# EAGLE design PIC_Workshop_V1 (EAGLE 9.4.0)
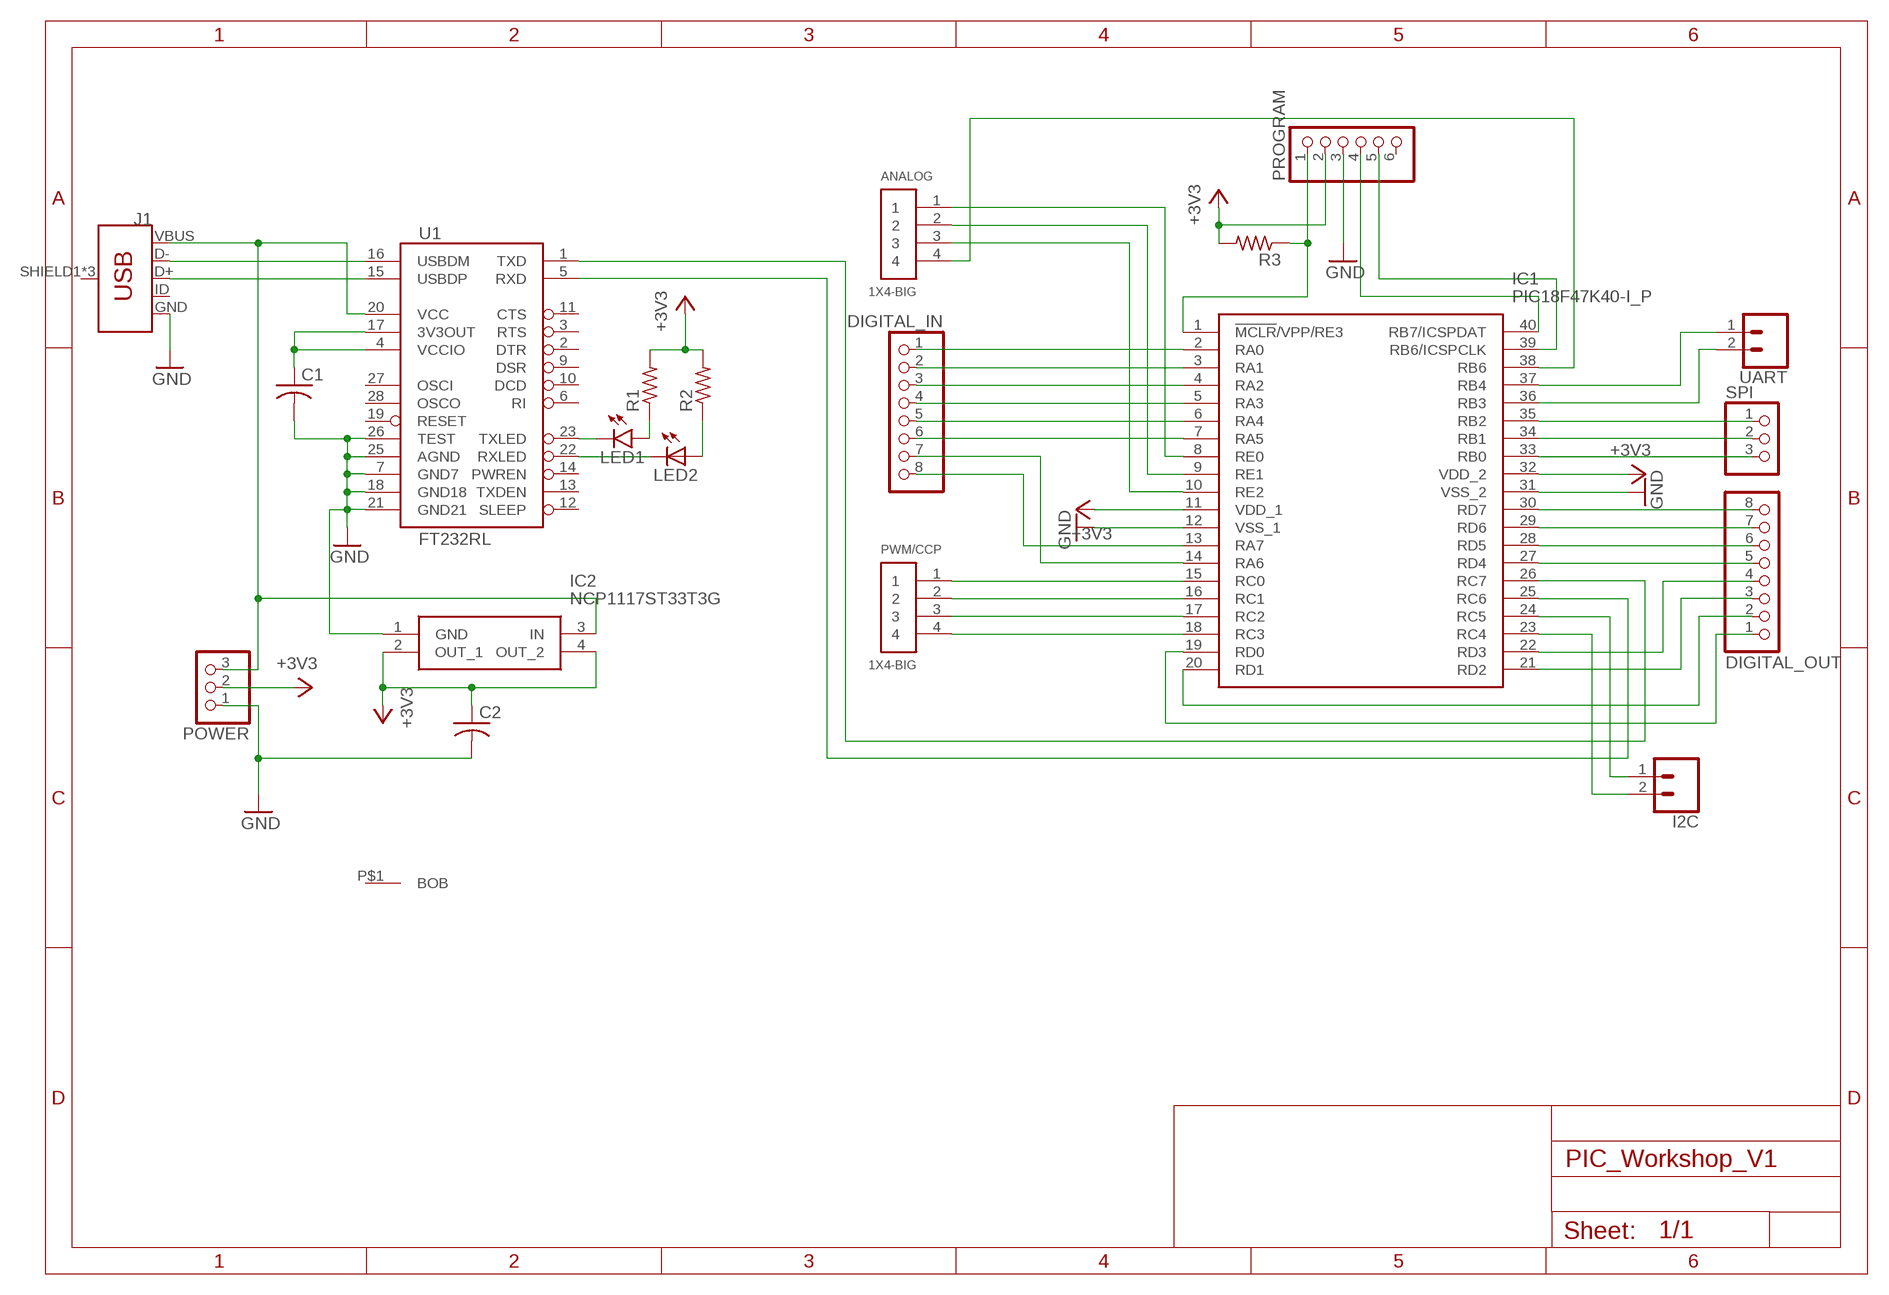
[diagram p0: schematic, sheet 1]

## Parts
ANALOG  1X4-BIG  [1X04-BIG]
C1  C-USC0805  [C0805]
C2  C-USC0805  [C0805]
DIGITAL_IN  PINHD-1X8BIG  [1X08-BIG]
DIGITAL_OUT  PINHD-1X8BIG  [1X08-BIG]
I2C  CONN_02  [1X02]
IC1  PIC18F47K40-I_P  [DIP1543W58P254L5175H635Q40N]
IC2  NCP1117ST33T3G  [SOT230P700X180-4N]
J1  USB_MICRO-BREDUCED_PASTE  [USB-B-MICRO-SMD_RED_PASTE]
LED1  LED3MM  [LED3MM]
LED2  LEDCHIPLED_0603  [CHIPLED_0603]
POWER  PINHD-1X3  [1X03]
PROGRAM  PINHD-1X6  [1X06]
PWM/CCP  1X4-BIG  [1X04-BIG]
R1  R-US_0204/7  [0204/7]
R2  R-US_M0805  [M0805]
R3  R-US_M0805  [M0805]
SPI  PINHD-1X3  [1X03]
U1  FT232RL  FT232RLSSOP  [SSOP28DB]
U$1  BOBBOB  [BOB]
UART  CONN_02  [1X02]

## Nets
+3V3: C2.1 IC1.11(VDD_1) IC1.32(VDD_2) IC2.2(OUT_1) IC2.4(OUT_2) POWER.2 PROGRAM.2 R1.2 R2.2 R3.2
GND: C1.2 C2.2 IC1.12(VSS_1) IC1.31(VSS_2) IC2.1(GND) J1.GND POWER.1 PROGRAM.3 U1.7(GND7) U1.18(GND18) U1.21(GND21) U1.25(AGND) U1.26(TEST)
N$1: J1.D- U1.16(USBDM)
N$2: J1.D+ U1.15(USBDP)
N$3: IC1.1(!MCLR!/VPP/RE3) PROGRAM.1 R3.1
N$4: IC1.40(RB7/ICSPDAT) PROGRAM.4
N$5: IC1.39(RB6/ICSPCLK) PROGRAM.5
N$6: DIGITAL_OUT.8 IC1.30(RD7)
N$7: DIGITAL_OUT.7 IC1.29(RD6)
N$8: DIGITAL_OUT.6 IC1.28(RD5)
N$9: DIGITAL_OUT.5 IC1.27(RD4)
N$10: DIGITAL_OUT.4 IC1.22(RD3)
N$11: DIGITAL_OUT.3 IC1.21(RD2)
N$12: DIGITAL_OUT.2 IC1.20(RD1)
N$13: DIGITAL_OUT.1 IC1.19(RD0)
N$14: DIGITAL_IN.1 IC1.2(RA0)
N$15: DIGITAL_IN.2 IC1.3(RA1)
N$16: DIGITAL_IN.3 IC1.4(RA2)
N$17: DIGITAL_IN.4 IC1.5(RA3)
N$18: DIGITAL_IN.5 IC1.6(RA4)
N$19: DIGITAL_IN.6 IC1.7(RA5)
N$20: DIGITAL_IN.7 IC1.14(RA6)
N$21: DIGITAL_IN.8 IC1.13(RA7)
N$22: ANALOG.1 IC1.8(RE0)
N$23: ANALOG.2 IC1.9(RE1)
N$24: ANALOG.3 IC1.10(RE2)
N$25: IC1.26(RC7) U1.1(TXD)
N$26: IC1.25(RC6) U1.5(RXD)
N$27: IC1.15(RC0) PWM/CCP.1
N$28: IC1.16(RC1) PWM/CCP.2
N$29: IC1.17(RC2) PWM/CCP.3
N$30: IC1.18(RC3) PWM/CCP.4
N$31: IC1.33(RB0) SPI.3
N$32: IC1.34(RB1) SPI.2
N$33: IC1.35(RB2) SPI.1
N$34: I2C.2 IC1.23(RC4)
N$35: I2C.1 IC1.24(RC5)
N$36: IC1.36(RB3) UART.2
N$37: IC1.37(RB4) UART.1
N$38: ANALOG.4 IC1.38(RB6)
N$39: IC2.3(IN) J1.VBUS POWER.3 U1.20(VCC)
N$40: LED1.K(C) U1.23(TXLED)
N$41: LED2.C U1.22(RXLED)
N$42: LED1.A R1.1
N$43: C1.1 U1.4(VCCIO) U1.17(3V3OUT)
N$44: LED2.A R2.1
Unconnected: J1.ID J1.SHIELD1(SHIELD) J1.SHIELD2(SHIELD) J1.SHIELD3(SHIELD) PROGRAM.6 U1.2(DTR) U1.3(RTS) U1.6(RI) U1.9(DSR) U1.10(DCD) U1.11(CTS) U1.12(SLEEP) U1.13(TXDEN) U1.14(PWREN) U1.19(RESET) U1.27(OSCI) U1.28(OSCO) U$1.P$1(BOB)

## Library data of the parts
ANALOG PWM/CCP = adafruit:1X4: 4-pin connector
C1 C2 = adafruit:C-US: CAPACITOR, American symbol
DIGITAL_IN DIGITAL_OUT = adafruit:PINHD-1X8: PIN HEADER
I2C UART = SparkFun-Connectors:CONN_02: Multi connection point. Often used as Generic Header-pin footprint for 0.1 inch spaced/style header connections On any of the 0.1 inch spaced packages, you can populate with these: Break Away Headers - Straight <https://www.sparkfun.com/products/116> (PRT-00116) Break Away Male Headers - Right Angle <https://www.sparkfun.com/products/553> (PRT-00553) Female Headers <https://www.sparkfun.com/products/115> (PRT-00115) Break Away Headers - Machine Pin <https://www.sparkfun.com/products/117> (PRT-00117) Break Away Female Headers - Swiss Machine Pin <https://www.sparkfun.com/products/743> (PRT-00743) For SCREWTERMINALS and SPRING TERMINALS visit here: Screw Terimnals on SparkFun.com <https://www.sparkfun.com/search/results?term=Screw+Terminals> (5mm/3.5mm/2.54mm spacing) This device is also useful as a general connection point to wire up your design to another part of your project. Our various solder wires solder well into these plated through hole pads. Hook-Up Wire - Assortment (Stranded, 22 AWG) <https://www.sparkfun.com/products/11375> (PRT-11375) Hook-Up Wire - Assortment (Solid Core, 22 AWG) <https://www.sparkfun.com/products/11367> (PRT-11367) View the entire wire category on our website here <https://www.sparkfun.com/categories/141> Special notes: Molex polarized connector foot print use with: PRT-08233 with associated crimp pins and housings. 2.54_SCREWTERM for use with PRT-10571. 3.5mm Screw Terminal footprints for PRT-08084 5mm Screw Terminal footprints for use with PRT-08432
IC1 = SamacSys_Parts:PIC18F47K40-I_P: MICROCHIP - PIC18F47K40-I/P - MCU, 8BIT, PIC18F, 64MHZ, DIP-40 Source: Datasheet <https://componentsearchengine.com/Datasheets/1/PIC18F47K40-I_P.pdf>; DESCRIPTION: MICROCHIP - PIC18F47K40-I/P - MCU, 8BIT, PIC18F, 64MHZ, DIP-40; HEIGHT: 6.35mm; MANUFACTURER_NAME: Microchip; MANUFACTURER_PART_NUMBER: PIC18F47K40-I/P; MOUSER_PART_NUMBER: 579-PIC18F47K40-I/P; MOUSER_PRICE-STOCK: https://www.mouser.com/Search/Refine.aspx?Keyword=579-PIC18F47K40-I%2FP
IC2 = SamacSys_Parts:NCP1117ST33T3G: ON SEMICONDUCTOR - NCP1117ST33T3G - IC, LINEAR VOLTAGE REGULATOR Source: Datasheet <https://componentsearchengine.com/Datasheets/1/NCP1117ST33T3G.pdf>; DESCRIPTION: ON SEMICONDUCTOR - NCP1117ST33T3G - IC, LINEAR VOLTAGE REGULATOR; HEIGHT: 1.8mm; MANUFACTURER_NAME: ON Semiconductor; MANUFACTURER_PART_NUMBER: NCP1117ST33T3G; MOUSER_PART_NUMBER: 863-NCP1117ST33T3G; MOUSER_PRICE-STOCK: https://www.mouser.com/Search/Refine.aspx?Keyword=863-NCP1117ST33T3G
J1 = SparkFun-Connectors:USB_MICRO-B: USB Type Micro-B Connector Male/female and PTH/SMT variants SparkFun Products: SparkFun microB USB Breakout <https://www.sparkfun.com/products/12035> SparkFun USB microB Plug Breakout <https://www.sparkfun.com/products/10031> SparkFun ESP8266 Thing <https://www.sparkfun.com/products/13231>; PROD_ID: CONN-11752
LED1 = led:LED: LED
LED2 = adafruit:LED: LED
POWER SPI = adafruit:PINHD-1X3: PIN HEADER
PROGRAM = adafruit:PINHD-1X6: PIN HEADER
R1-R3 = adafruit:R-US_: RESISTOR, American symbol
U1 = SparkFun-IC-Comms:FT232RL: FT232RL USB UART FT232RL 4th Generation USB UART (USB <-> Serial) Controller. Datasheet <http://www.sparkfun.com/datasheets/IC/FT232R_v104.pdf> SparkFun Products Component <https://www.sparkfun.com/products/650> (COM-00650) SparkFun RedBot Mainboard <https://www.sparkfun.com/products/12097> (ROB-12097) SparkFun FTDI Basic Breakout - 5V <https://www.sparkfun.com/products/9716> (DEV-09716) SparkFun FTDI Basic Breakout - 3.3V <https://www.sparkfun.com/products/9873> (DEV-09873) Bus Pirate - v3.6a <https://www.sparkfun.com/products/12942> (TOL-12942) SparkFun USB to Serial Breakout - FT232RL <https://www.sparkfun.com/products/12731> (BOB-12731) SparkFun PicoBoard <https://www.sparkfun.com/products/11888> (WIG-11888) SparkFun RFID USB Reader <https://www.sparkfun.com/products/9963> (SEN-09963) LilyPad FTDI Basic Breakout - 5V <https://www.sparkfun.com/products/10275> (DEV-10275) SparkFun Stepoko <https://www.sparkfun.com/products/13899> (ROB-13899); PROD_ID: IC-00870
U$1 = EEL:BOB

## Board
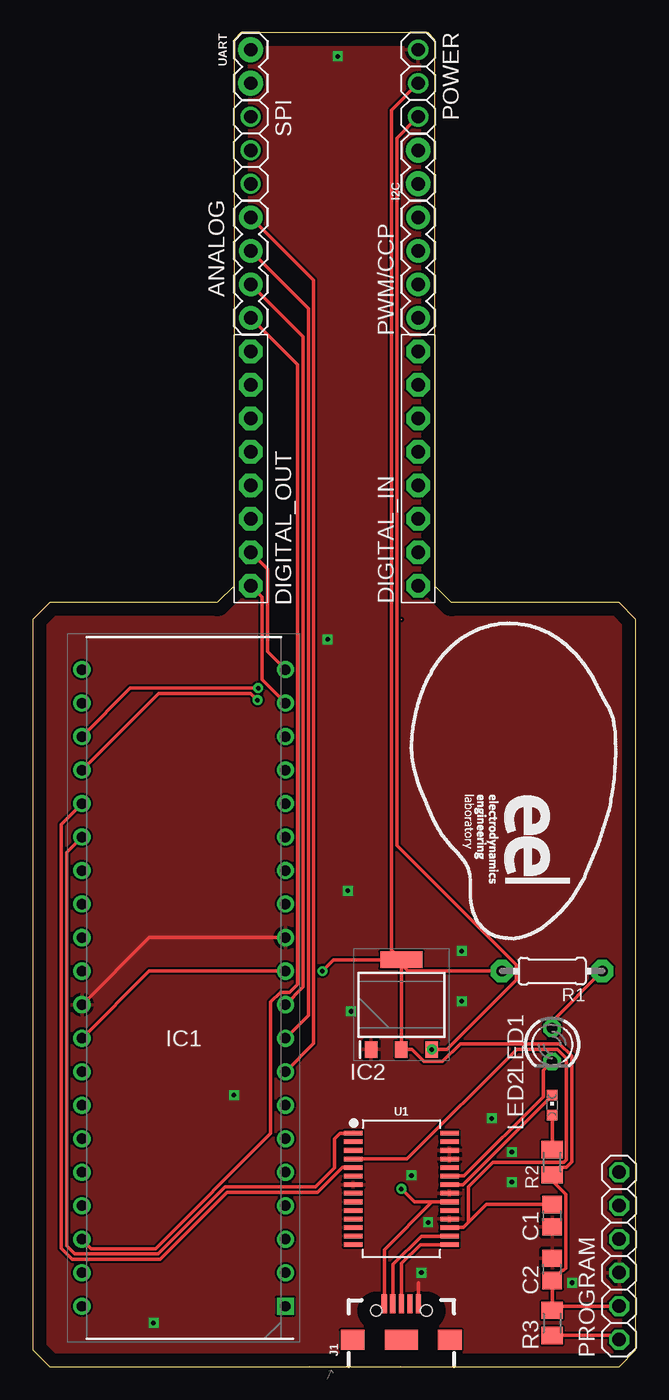
[diagram p1: board, top side]
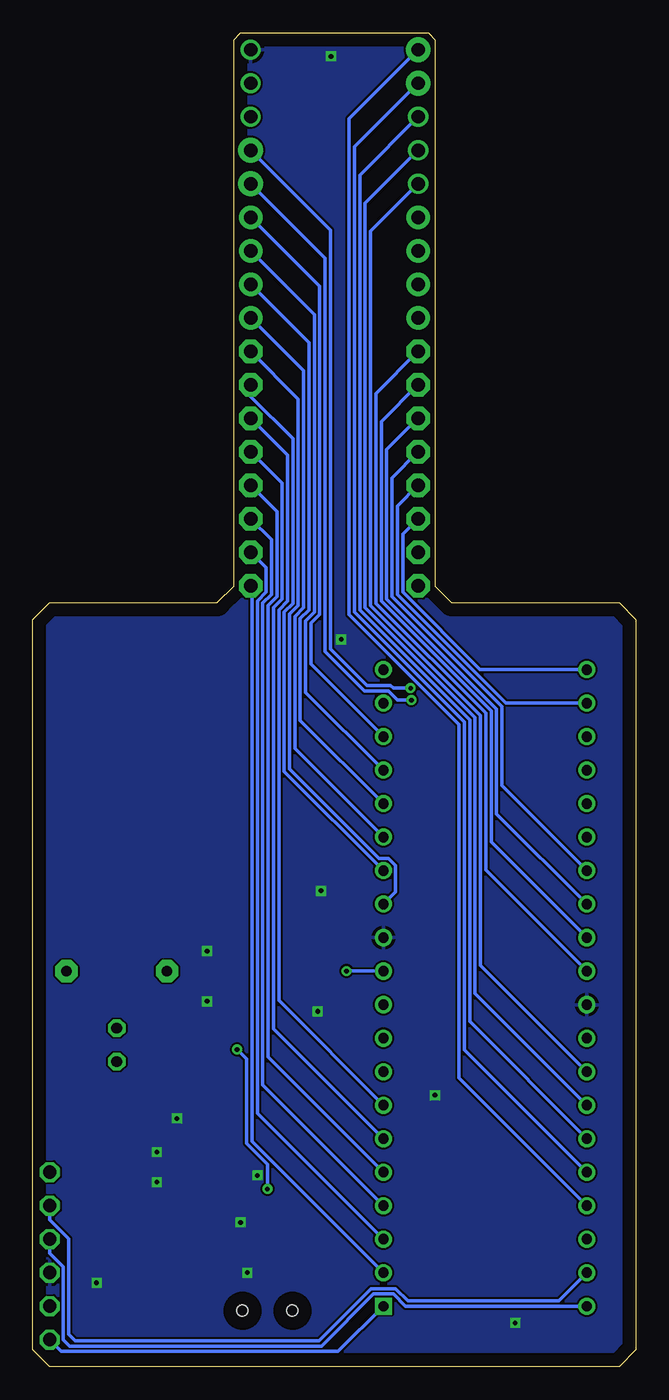
[diagram p2: board, bottom side, seen from below]

Size 45.72 x 101.09 mm. Coordinates in mm from the lower left corner, seen from the top.
Outline: 0,1.27 1.27,0 44.45,0 45.72,1.27 45.72,56.64 44.45,57.91 31.75,57.91 30.48,59.18 30.48,100.58 29.97,101.09 15.75,101.09 15.24,100.58 15.24,59.18 13.97,57.91 1.27,57.91 0,56.64 0,1.27
Copper layers (1*16): Top 0.035mm / dielectric 1.5mm / Bottom 0.035mm
Design rules "default *": minimum track width 6mil, minimum drill 0.35mm, track to track 6mil, track to pad 6mil, pad to pad 6mil, via to via 6mil, smd to smd 6mil, copper to edge 40mil, drill to drill 6mil, minimum pad ring 10mil, minimum via ring 8mil, stop-mask expansion 4mil, vias tented up to drill 0mil, thermal gap 10mil

### Footprints (pad centres in the part's own frame; a part is rotated, then mirrored left to right if it is on the bottom)
1X04-BIG = drill 1.016 pad 1.778: 1 0,0; 2 2.54,0; 3 5.08,0; 4 7.62,0
C0805 = smd 1.3 x 1.5: 1 -0.85,0; 2 0.85,0
1X08-BIG = drill 1.016 pad 1.778 octagon: 1 -8.89,0; 2 -6.35,0; 3 -3.81,0; 4 -1.27,0; 5 1.27,0; 6 3.81,0; 7 6.35,0; 8 8.89,0
1X02 = drill 1.016 pad 1.88: 1 0,0; 2 2.54,0
DIP1543W58P254L5175H635Q40N = drill 0.784 pad 1.184 square: 1 -7.715,24.13 | drill 0.784 pad 1.184: 2 -7.715,21.59; 3 -7.715,19.05; 4 -7.715,16.51; 5 -7.715,13.97; 6 -7.715,11.43; 7 -7.715,8.89; 8 -7.715,6.35; 9 -7.715,3.81; 10 -7.715,1.27; 11 -7.715,-1.27; 12 -7.715,-3.81; 13 -7.715,-6.35; 14 -7.715,-8.89; 15 -7.715,-11.43; 16 -7.715,-13.97; 17 -7.715,-16.51; 18 -7.715,-19.05; 19 -7.715,-21.59; 20 -7.715,-24.13; 21 7.715,-24.13; 22 7.715,-21.59; 23 7.715,-19.05; 24 7.715,-16.51; 25 7.715,-13.97; 26 7.715,-11.43; 27 7.715,-8.89; 28 7.715,-6.35; 29 7.715,-3.81; 30 7.715,-1.27; 31 7.715,1.27; 32 7.715,3.81; 33 7.715,6.35; 34 7.715,8.89; 35 7.715,11.43; 36 7.715,13.97; 37 7.715,16.51; 38 7.715,19.05; 39 7.715,21.59; 40 7.715,24.13
SOT230P700X180-4N = smd 1.25 x 0.95: 1 -3.4,2.3; 2 -3.4,0; 3 -3.4,-2.3 | smd 1.25 x 3.2: 4 3.4,0
USB-B-MICRO-SMD_RED_PASTE = smd 1.45 x 0.4: D+ 2.725,0; D- 2.725,0.65; GND 2.725,-1.3; ID 2.725,-0.65; VBUS 2.725,1.3 | smd 1.5 x 1.8: SHIELD1 0,3.685; SHIELD2 0,-3.685 | smd 1.5 x 2.5: SHIELD3 0,0 | hole 0.85: 2.2,1.9; 2.2,-1.9
LED3MM = drill 0.813 octagon: A -1.27,0; K 1.27,0
CHIPLED_0603 = smd 0.8 x 0.8: A 0,-0.75; C 0,0.75
1X03 = drill 1.016: 1 -2.54,0; 2 0,0; 3 2.54,0
1X06 = drill 1.016 octagon: 1 -6.35,0; 2 -3.81,0; 3 -1.27,0; 4 1.27,0; 5 3.81,0; 6 6.35,0
0204/7 = drill 0.813 pad 1.676 octagon: 1 -3.81,0; 2 3.81,0
M0805 = smd 1.3 x 1.6: 1 -0.95,0; 2 0.95,0
SSOP28DB = smd 0.348 x 1.397: 1 -4.225,-3.656; 2 -3.575,-3.656; 3 -2.925,-3.656; 4 -2.275,-3.656; 5 -1.625,-3.656; 6 -0.975,-3.656; 7 -0.325,-3.656; 8 0.325,-3.656; 9 0.975,-3.656; 10 1.625,-3.656; 11 2.275,-3.656; 12 2.925,-3.656; 13 3.575,-3.656; 14 4.225,-3.656; 15 4.225,3.656; 16 3.575,3.656; 17 2.925,3.656; 18 2.275,3.656; 19 1.625,3.656; 20 0.975,3.656; 21 0.325,3.656; 22 -0.325,3.656; 23 -0.975,3.656; 24 -1.625,3.656; 25 -2.275,3.656; 26 -2.925,3.656; 27 -3.575,3.656; 28 -4.225,3.656
BOB = smd 0.127 x 0.127: P$1 0,0

### Placement (x,y rotation side)
ANALOG  16.51,87.12 270 top
C1  39.37,11.43 270 top
C2  39.37,7.37 90 top
DIGITAL_IN  29.21,68.07 90 top
DIGITAL_OUT  16.51,68.07 90 top
I2C  29.21,89.66 90 top
IC1  11.43,28.7 180 top
IC2  27.94,27.43 90 top
J1  27.94,2.03 90 top
LED1  39.37,24.38 270 top
LED2  39.37,19.81 0 top
POWER  29.21,97.28 270 top
PROGRAM  44.45,8.38 90 top
PWM/CCP  29.21,79.5 90 top
R1  39.37,29.97 180 top
R2  39.37,15.49 270 top
R3  39.37,3.3 90 top
SPI  16.51,92.2 270 top
U1  27.94,13.46 270 top
U$1  27.94,56.64 270 top
UART  16.51,99.82 270 top

### Tracks (layer width: path | path; a pad name or v marks a point on that pad's centre or on a via)
+3V3  (via drill 0.35)
  Top 0.254: 27.94,30.48 IC2.2 28.75,24.03 29.65,23.13 31.07,23.13 32.4,24.46 39.93,24.46 40.86,23.53 40.86,15.51 40.43,15.09 39.91,15.09 R2.2 39.37,14.07 40.4,13.05 40.4,7.45 40.24,7.29 40.14,7.29 C2.1 R3.2 39.69,4.57 PROGRAM.2 | 27.94,30.48 IC2.4 | R1.2 28.45,29.97 27.94,30.48 | POWER.2 27.18,95.25 27.18,31.59 IC2.4 | IC1.32 8.79,29.97 IC1.11 | v21.95,29.97 22.81,30.83 IC2.4
  Bottom 0.254: IC1.11 v21.95,29.97
GND  (via drill 0.35)
  Top 0.254: J1.GND 29.24,6.35 | IC1.31 8.79,32.51 IC1.12
  other vias: 23.11,99.31 22.35,55.12 23.88,36.07 28.7,14.48 29.46,7.11 40.89,6.35 36.32,13.97 36.32,16.26 34.8,18.8 24.13,26.92 15.24,20.57 32.51,27.69 32.51,31.5 9.14,3.3 29.97,10.92
  pour Top: 0,-0.51 45.72,-0.51 45.72,85.85 30.48,101.09 15.24,101.09 0,85.85
  pour Bottom: 0,-0.51 0,85.85 15.24,101.09 30.48,101.09 45.72,85.85 45.72,-0.51
N$1
  Top 0.254: J1.D- 27.29,7.73 29.45,9.89 U1.16
N$2
  Top 0.254: U1.15 29.37,9.24 27.94,7.81 J1.D+
N$3
  Top 0.254: R3.1 44.13,2.35 PROGRAM.1
  Bottom 0.254: IC1.1 22.57,1.14 43.56,1.14 PROGRAM.1
N$4
  Bottom 0.254: IC1.40 17.46,4.57 18.38,5.5 19.91,5.5 23.86,1.55 42.93,1.55 43.41,2.03 43.41,7.54 44.45,8.59 PROGRAM.4
N$5
  Bottom 0.254: IC1.39 5.85,4.98 17.29,4.98 18.21,5.9 20.07,5.9 24.02,1.96 42.5,1.96 43,2.45 43,9.68 44.45,11.12 PROGRAM.5
N$6
  Bottom 0.254: IC1.30 11.38,37.64 11.38,49.52 19.71,57.86 19.71,73.76 DIGITAL_OUT.8
N$7
  Bottom 0.254: IC1.29 10.97,39.77 10.97,49.69 19.3,58.02 19.3,71.63 DIGITAL_OUT.7
N$8
  Bottom 0.254: IC1.28 10.57,41.9 10.57,49.86 18.9,58.19 18.9,69.49 DIGITAL_OUT.6
N$9
  Bottom 0.254: IC1.27 10.16,44.04 10.16,50.03 18.49,58.36 18.49,67.36 DIGITAL_OUT.5
N$10
  Bottom 0.254: IC1.22 9.85,50.29 18.09,58.53 18.09,65.23 DIGITAL_OUT.4
N$11
  Bottom 0.254: IC1.21 11.81,52.83 17.68,58.7 17.68,63.09 DIGITAL_OUT.3
N$12
  Top 0.254: IC1.20 17.78,54.2 17.78,60.45 DIGITAL_OUT.2
N$13
  Top 0.254: DIGITAL_OUT.1 17.37,58.32 17.37,52.06 IC1.19
N$14
  Bottom 0.254: IC1.2 29.11,17.07 29.11,59.08 DIGITAL_IN.1
N$15
  Bottom 0.254: DIGITAL_IN.2 28.04,60.55 28.04,58.7 28.7,58.04 28.7,19.21 IC1.3
N$16
  Bottom 0.254: IC1.4 28.3,21.34 28.3,57.87 27.64,58.53 27.64,62.69 DIGITAL_IN.3
N$17
  Bottom 0.254: DIGITAL_IN.4 27.23,64.82 27.23,58.36 27.89,57.7 27.89,23.48 IC1.5
N$18
  Bottom 0.254: DIGITAL_IN.5 26.82,66.95 26.82,58.19 27.48,57.53 27.48,25.61 IC1.6
N$19
  Bottom 0.254: IC1.7 27.08,27.74 27.08,57.36 26.42,58.02 26.42,69.09 DIGITAL_IN.6
N$20
  Bottom 0.254: DIGITAL_IN.7 29.21,73.53 26.01,70.33 26.01,57.86 26.67,57.2 26.67,45.12 IC1.14
N$21
  Bottom 0.254: DIGITAL_IN.8 25.6,73.36 25.6,57.69 26.26,57.03 26.26,45.31 19.47,38.52 18.76,38.52 18.22,37.97 18.22,35.98 IC1.13
N$22
  Top 0.254: ANALOG.1 21.29,82.34 21.29,24.5 IC1.8
N$23
  Top 0.254: IC1.9 20.88,26.63 20.88,80.21 ANALOG.2
N$24
  Top 0.254: ANALOG.3 20.48,78.08 20.48,28.76 IC1.10
N$25
  Top 0.254: U1.1 23.27,17.69 22.86,17.27 22.86,15.05 21.42,13.61 14.56,13.61 9.48,8.53 3.15,8.53 2.54,9.14 2.54,38.96 IC1.26
N$26
  Top 0.254: U1.5 23.47,15.09 21.59,13.21 14.73,13.21 9.65,8.13 4.83,8.13 2.98,8.13 2.13,8.98 2.13,41.09 IC1.25
N$27
  Bottom 0.254: PWM/CCP.1 25.2,75.49 25.2,57.52 25.86,56.86 25.86,46.84 IC1.15
N$28
  Bottom 0.254: IC1.16 25.45,48.98 25.45,56.69 24.79,57.35 24.79,77.62 PWM/CCP.2
N$29
  Bottom 0.254: PWM/CCP.3 24.38,79.76 24.38,57.18 25.04,56.52 25.04,51.11 IC1.17
N$30
  Bottom 0.254: IC1.18 24.64,53.24 24.64,56.35 23.98,57.02 23.98,81.89 PWM/CCP.4
N$31
  Bottom 0.254: IC1.33 11.79,30.42 11.79,49.36 20.12,57.69 20.12,86.06 SPI.3
N$32
  Bottom 0.254: SPI.2 20.52,88.19 20.52,57.52 12.19,49.19 12.19,28.29 IC1.34
N$33
  Bottom 0.254: IC1.35 12.6,26.16 12.6,49.02 20.93,57.35 20.93,90.32 SPI.1
N$34  (via drill 0.35)
  Top 0.254: IC1.23 7.39,51.42 v17.08,51.42
  Bottom 0.254: I2C.2 23.16,86.16 23.16,54.38 20.41,51.62 18.59,51.62 18.39,51.42 v17.08,51.42
N$35  (via drill 0.35)
  Top 0.254: IC1.24 9.52,51.02 16.52,51.02 v17.02,50.52
  Bottom 0.254: v17.02,50.52 18.06,50.52 18.76,51.22 20.57,51.22 23.57,54.21 23.57,84.02 I2C.1
N$36
  Bottom 0.254: UART.2 21.34,92.46 21.34,57.18 13.01,48.85 13.01,24.02 IC1.36
N$37
  Bottom 0.254: IC1.37 13.41,21.89 13.41,48.68 21.74,57.02 21.74,94.59 UART.1
N$38
  Top 0.254: ANALOG.4 20.07,75.94 20.07,28.96 19.47,28.36 18.76,28.36 18.03,27.63 18.03,17.66 9.31,8.94 4.43,8.94 IC1.38
N$39  (via drill 0.35)
  Top 0.254: U1.20 30.27,12.49 | J1.VBUS 26.64,8.86 30.27,12.49 | IC2.3 31.4,24.03 36.68,29.31 36.68,30.44 27.6,39.52 27.6,93.13 POWER.3 | 30.27,12.49 28.91,12.49 v27.94,13.46
  Bottom 0.254: v27.94,13.46 27.94,15.33 29.52,16.91 29.52,23.31 IC2.3
  other vias: 30.24,24.03
N$40
  Top 0.254: U1.23 32.67,14.44 38.69,20.46 38.69,22.44 LED1.K
N$41
  Top 0.254: U1.22 32.59,13.79 LED2.C
N$42
  Top 0.254: LED1.A 39.37,26.16 R1.1
N$43
  Top 0.254: U1.17 32.63,10.54 33.02,10.92 | 33.02,10.92 33.02,13.64 34.88,15.49 40.27,15.49 40.45,15.68 40.45,23.36 39.76,24.05 36.7,24.05 28.38,15.74 U1.4 | C1.1 34.38,12.28 33.02,10.92
N$44
  Top 0.254: R2.1 LED2.A